# EAGLE design tdlf_23_10_2021_server (EAGLE 9.6.2)
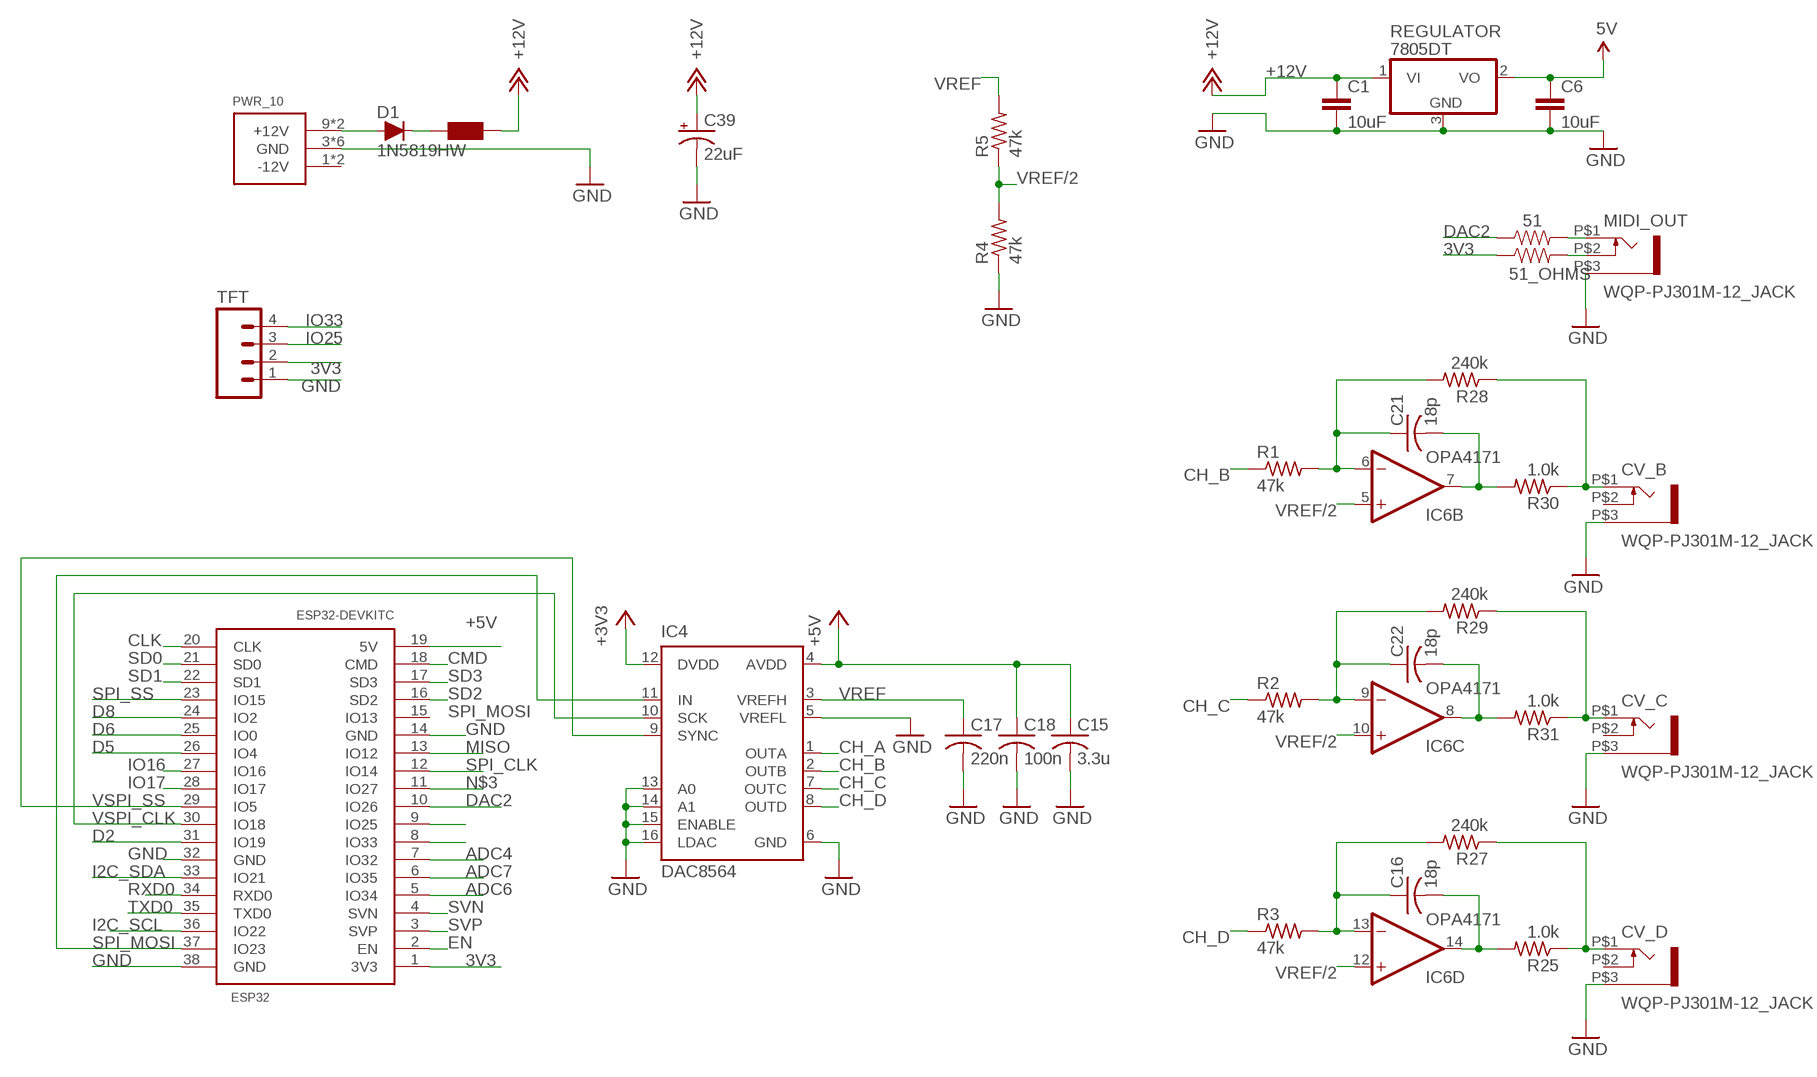
[diagram p0: schematic, sheet 1]

## Parts
51  RESISTOR1206  [1206]
51_OHMS  RESISTOR1206  [1206]
C1  10uF  CAPACITOR1210  [R1210]
C6  10uF  CAPACITOR1210  [R1210]
C15  3.3u  C-USC0603  [C0603]
C16  18p  C-USC0603  [C0603]
C17  220n  C-USC0603  [C0603]
C18  100n  C-USC0603  [C0603]
C21  18p  C-USC0603  [C0603]
C22  18p  C-USC0603  [C0603]
C39  22uF  CAP_POL1206_TANT  [1206_POL]
CV_B  WQP-PJ301M-12_JACK  [WQP-PJ301M-12_JACK]
CV_C  WQP-PJ301M-12_JACK  [WQP-PJ301M-12_JACK]
CV_D  WQP-PJ301M-12_JACK  [WQP-PJ301M-12_JACK]
D1  1N5819HW  DIODE  [SOD123]
ESP32  ESP32DEVKITC  [ESP32-DEVKITC]
F1  Würth Electronics 742792664  FERRITE-BEAD0805  [R0805]
IC4  DAC8564  [SOP65P640X110-16N]
IC6  OPA4171  TL074D  [SO14]
MIDI_OUT  WQP-PJ301M-12_JACK  [WQP-PJ301M-12_JACK]
PWR_10  POWER_SIMPLE10  [POWER_10]
R1  47k  R-US_R1206  [R1206]
R2  47k  R-US_R1206  [R1206]
R3  47k  R-US_R1206  [R1206]
R4  47k  R-US_R1206  [R1206]
R5  47k  R-US_R1206  [R1206]
R25  1.0k  R-US_R0603  [R0603]
R27  240k  R-US_R0603  [R0603]
R28  240k  R-US_R0603  [R0603]
R29  240k  R-US_R0603  [R0603]
R30  1.0k  R-US_R0603  [R0603]
R31  1.0k  R-US_R0603  [R0603]
REGULATOR  7805DT  [TO252]
TFT  M04PTH  [1X04]

## Nets
3V: 51_OHMS.2 MIDI_OUT.P$2
3V3: 51_OHMS.1 ESP32.1(3V3) TFT.2
+3V3: IC4.12(DVDD)
+5V: C6.1 C15.1 C18.1 ESP32.19(5V) IC4.4(AVDD) REGULATOR.2(VO) ; supply symbol labelled 5V
+12: D1.+ PWR_10.9(+12V) PWR_10.10(+12V)
+12V: C1.1 C39.2(+) F1.1 REGULATOR.1(VI)
ADC4: ESP32.7(IO32)
ADC6: ESP32.5(IO34)
ADC7: ESP32.6(IO35)
CH_A: IC4.1(OUTA)
CH_B: IC4.2(OUTB) R1.1
CH_C: IC4.7(OUTC) R2.1
CH_D: IC4.8(OUTD) R3.1
CLK: ESP32.20(CLK)
CMD: ESP32.18(CMD)
D2: ESP32.31(IO19)
D5: ESP32.26(IO4)
D6: ESP32.25(IO0)
D8: ESP32.24(IO2)
DAC2: 51.1 ESP32.10(IO26)
EN: ESP32.2(EN)
GND: C1.2 C6.2 C15.2 C17.2 C18.2 C39.1(-) CV_B.P$3 CV_C.P$3 CV_D.P$3 ESP32.14(GND) ESP32.32(GND) ESP32.38(GND) IC4.5(VREFL) IC4.6(GND) IC4.13(A0) IC4.14(A1) IC4.15(ENABLE) IC4.16(LDAC) MIDI_OUT.P$3 PWR_10.3(GND) PWR_10.4(GND) PWR_10.5(GND) PWR_10.6(GND) PWR_10.7(GND) PWR_10.8(GND) R4.1 REGULATOR.3(GND) TFT.1
I2C_SCL: ESP32.36(IO22)
I2C_SDA: ESP32.33(IO21)
IO16: ESP32.27(IO16)
IO17: ESP32.28(IO17)
IO25: ESP32.9(IO25) TFT.3
IO33: ESP32.8(IO33) TFT.4
MISO: ESP32.13(IO12)
N$2: C22.1 IC6.9(C:-IN) R2.2 R29.2
N$3: ESP32.11(IO27)
N$47: D1.- F1.2
N$50: C21.2 IC6.7(B:OUT) R30.2
N$51: C22.2 IC6.8(C:OUT) R31.2
N$52: C16.2 IC6.14(D:OUT) R25.2
N$55: CV_C.P$1 R29.1 R31.1
N$58: CV_D.P$1 R25.1 R27.1
N$59: C16.1 IC6.13(D:-IN) R3.2 R27.2
N$60: C21.1 IC6.6(B:-IN) R1.2 R28.2
N$63: CV_B.P$1 R28.1 R30.1
PIN27: 51.2 MIDI_OUT.P$1
RXD0: ESP32.34(RXD0)
SD0: ESP32.21(SD0)
SD1: ESP32.22(SD1)
SD2: ESP32.16(SD2)
SD3: ESP32.17(SD3)
SPI_CLK: ESP32.12(IO14)
SPI_MOSI: ESP32.37(IO23) IC4.11(IN)
SPI_SS: ESP32.23(IO15)
SVN: ESP32.4(SVN)
SVP: ESP32.3(SVP)
TXD0: ESP32.35(TXD0)
VREF: C17.1 IC4.3(VREFH) R5.2
VREF/2: IC6.5(B:+IN) IC6.10(C:+IN) IC6.12(D:+IN) R4.2 R5.1
VSPI_CLK: ESP32.30(IO18) IC4.10(SCK)
VSPI_SS: ESP32.29(IO5) IC4.9(SYNC)
Unconnected: CV_B.P$2 CV_C.P$2 CV_D.P$2 ESP32.15(IO13) IC6.1(A:OUT) IC6.2(A:-IN) IC6.3(A:+IN) PWR_10.1(-12V) PWR_10.2(-12V)

## Power pins joined to a net without a drawn wire
V+: IC6.4(P:V+)
V-: IC6.11(P:V-)

## Library data of the parts
51 51_OHMS = SparkFun-Resistors:RESISTOR: Generic Resistor Package
C1 C6 = parts_aman:CAPACITOR
C15-C18 C21 C22 = rcl:C-US: CAPACITOR, American symbol
C39 = parts_aman:CAP_POL
CV_B CV_C CV_D MIDI_OUT = thonkiconn:WQP-PJ301M-12_JACK
D1 = parts_aman:DIODE
ESP32 = ESP32-DEVKITC:ESP32DEVKITC
F1 = parts_aman:FERRITE-BEAD
IC4 = og-dac:DAC8564
IC6 = gm-ics:TL074: OP AMP
PWR_10 = parts_aman:POWER_SIMPLE
R1-R5 = rcl:R-US_: RESISTOR, American symbol; SPICEPREFIX: R
R25 R27-R31 = rcl:R-US_: RESISTOR, American symbol
REGULATOR = linear:78*: Positive VOLTAGE REGULATOR Source: http://cache.national.com/ds/LM/LM78L05.pdf http://www.fairchildsemi.com/ds/LM/LM7805.pdf
TFT = SparkFun-Connectors:M04: Header 4 Standard 4-pin 0.1" header. Use with straight break away headers (SKU : PRT-00116), right angle break away headers (PRT-00553), swiss pins (PRT-00743), machine pins (PRT-00117), and female headers (PRT-00115). Molex polarized connector foot print use with SKU : PRT-08231 with associated crimp pins and housings. 1MM SMD Version SKU: PRT-10208

## Board
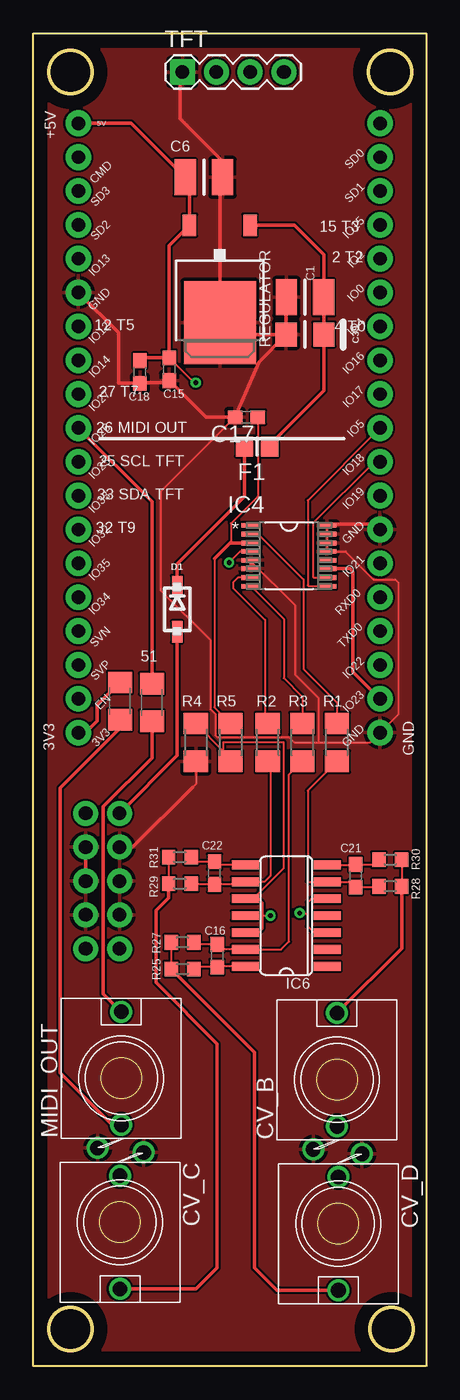
[diagram p1: board, top side]
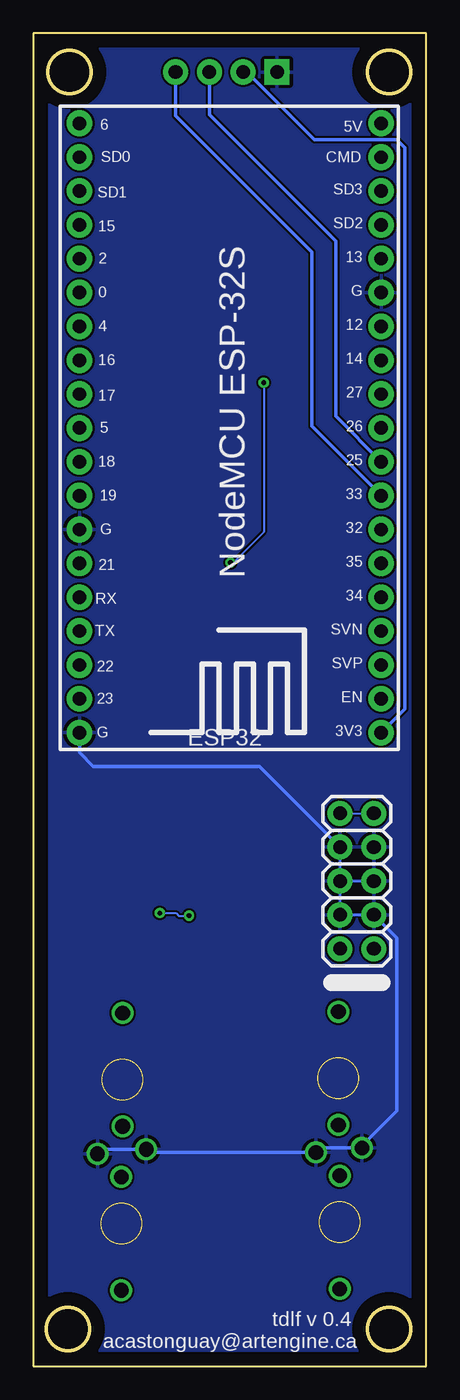
[diagram p2: board, bottom side, seen from below]

Size 29.5 x 100 mm. Coordinates in mm from the lower left corner, seen from the top.
Outline: 0,0 0,100 29.5,100 29.5,0 0,0
Outline: circle at 26.8,97.1 radius 1.62
Outline: circle at 2.8,97.1 radius 1.62
Outline: circle at 2.8,2.8 radius 1.62
Outline: circle at 26.9,2.8 radius 1.62
Copper layers (1*16): Top 0.035mm / dielectric 1.5mm / Bottom 0.035mm
Design rules "default": minimum track width 6mil, minimum drill 0.35mm, track to track 6mil, track to pad 6mil, pad to pad 6mil, via to via 6mil, smd to smd 6mil, copper to edge 40mil, drill to drill 6mil, minimum pad ring 10mil, minimum via ring 8mil, stop-mask expansion 4mil, vias tented up to drill 0mil, thermal gap 10mil

### Footprints (pad centres in the part's own frame; a part is rotated, then mirrored left to right if it is on the bottom)
1206 = smd 1.6 x 1.8: 1 -1.4,0; 2 1.4,0
R1210 = smd 1.6 x 2.7: 1 -1.4,0; 2 1.4,0
C0603 = smd 1.1 x 1: 1 -0.85,0; 2 0.85,0
1206_POL = smd 1.6 x 1.803: 1 -1.422,0; 2 1.422,0
WQP-PJ301M-12_JACK = drill 1.1: P$1 0,5; P$2 0,-3.5; P$3 -1.778,-5.23
SOD123 = smd 1.6 x 0.8: + 1.7,0; - -1.7,0
ESP32-DEVKITC = drill 1 pad 1.93: 1 -22.87,-11.42; 2 -20.33,-11.42; 3 -17.79,-11.42; 4 -15.25,-11.42; 5 -12.71,-11.42; 6 -10.17,-11.42; 7 -7.63,-11.42; 8 -5.09,-11.42; 9 -2.55,-11.42; 10 -0.01,-11.42; 11 2.53,-11.42; 12 5.07,-11.42; 13 7.61,-11.42; 14 10.15,-11.42; 15 12.69,-11.42; 16 15.23,-11.42; 17 17.77,-11.42; 18 20.31,-11.42; 19 22.85,-11.42; 20 22.85,11.23; 21 20.31,11.23; 22 17.77,11.23; 23 15.23,11.23; 24 12.69,11.23; 25 10.15,11.23; 26 7.61,11.23; 27 5.07,11.23; 28 2.53,11.23; 29 -0.01,11.23; 30 -2.55,11.23; 31 -5.09,11.23; 32 -7.63,11.23; 33 -10.17,11.23; 34 -12.71,11.23; 35 -15.25,11.23; 36 -17.79,11.23; 37 -20.33,11.23; 38 -22.87,11.23
R0805 = smd 1.3 x 1.5: 1 -0.95,0; 2 0.95,0
SOP65P640X110-16N = smd 1.422 x 0.356: 1 -2.845,2.286; 2 -2.845,1.626; 3 -2.845,0.965; 4 -2.845,0.33; 5 -2.845,-0.33; 6 -2.845,-0.965; 7 -2.845,-1.626; 8 -2.845,-2.286; 9 2.845,-2.286; 10 2.845,-1.626; 11 2.845,-0.965; 12 2.845,-0.33; 13 2.845,0.33; 14 2.845,0.965; 15 2.845,1.626; 16 2.845,2.286
SO14 = smd 0.66 x 2.032: 1 -3.81,-3.073; 2 -2.54,-3.073; 3 -1.27,-3.073; 4 0,-3.073; 5 1.27,-3.073; 6 2.54,-3.073; 7 3.81,-3.073; 8 3.81,3.073; 9 2.54,3.073; 10 1.27,3.073; 11 0,3.073; 12 -1.27,3.073; 13 -2.54,3.073; 14 -3.81,3.073
POWER_10 = drill 1.016 pad 1.88: 1 -5.08,-1.27; 2 -5.08,1.27; 3 -2.54,-1.27; 4 -2.54,1.27; 5 0,-1.27; 6 0,1.27; 7 2.54,-1.27; 8 2.54,1.27; 9 5.08,-1.27; 10 5.08,1.27
R1206 = smd 1.6 x 1.803: 1 -1.422,0; 2 1.422,0
R0603 = smd 1 x 1.1: 1 -0.85,0; 2 0.85,0
TO252 = smd 1 x 1.6: 1 -2.28,-4.8; 2 2.28,-4.8 | smd 5.4 x 6.2: 3 0,2.5
1X04 = drill 1.016 pad 1.88 square: 1 0,0 | drill 1.016 pad 1.88: 2 2.54,0; 3 5.08,0; 4 7.62,0

### Placement (x,y rotation side)
51  8.9,49.8 270 top
51_OHMS  6.5,49.9 270 top
C1  20.4,80.2 180 top
C6  12.8,89.2 0 top
C15  10.2,74.8 270 top
C16  13.8,30.8 270 top
C17  16,71.2 180 top
C18  8,74.6 270 top
C21  24.2,36.8 90 top
C22  13.6,37 90 top
C39  20.4,77.4 0 top
CV_B  22.8,21.5 0 top
CV_C  6.5,10.8 180 top
CV_D  22.9,10.7 180 top
D1  10.8,56.8 270 top
ESP32  14.8,70.4 90 bottom
F1  16.8,69 180 top
IC4  19.2,60.8 0 top
IC6  19,33.8 90 top
MIDI_OUT  6.6,21.6 0 top
PWR_10  5.2,36.4 90 bottom
R1  22.8,46.8 270 top
R2  17.6,46.8 270 top
R3  20.2,46.8 270 top
R4  12.2,46.8 90 top
R5  14.8,46.8 90 top
R25  11.2,29.8 0 top
R27  11.2,31.8 0 top
R28  26.8,36 180 top
R29  11,36.2 0 top
R30  26.8,38 180 top
R31  11,38.2 0 top
REGULATOR  14,80.8 180 top
TFT  11.2,97.1 0 top

### Tracks (layer width: path | path; a pad name or v marks a point on that pad's centre or on a via)
3V
  Top 0.254: 51_OHMS.2 6.5,47.9 2,43.4 2,22 5.9,18.1 MIDI_OUT.P$2
3V3
  Top 0.254: 51_OHMS.1 4.8,49.6 4.8,48.4 3.93,47.53 ESP32.1
  Bottom 0.254: TFT.2 13.47,97.1 8.38,92 2.21,92 1.6,91.4 1.6,49.31 ESP32.1
+5V  (via drill 0.35)
  Top 0.152: C15.1 12.05,73.8 v12.2,73.8 | v14.7,60.3 15.53,61.13 IC4.4
  Top 0.254: C18.1 8.2,75.65 C15.1 10.2,84.08 REGULATOR.2 11.72,88.88 C6.1 7.35,93.25 ESP32.19
  Bottom 0.152: v12.2,73.8 12.2,62.6 14.6,60.2 v14.7,60.3
+12
  Top 0.254: D1.+ 10.8,45.81 PWR_10.10
  Bottom 0.152: PWR_10.10 PWR_10.9
+12V
  Top 0.254: F1.1 17.75,69.13 21.82,73.2 C39.2 21.82,80.18 C1.1 21.8,83.4 19.6,85.6 REGULATOR.1
CH_B
  Top 0.152: R1.1 22.8,49.8 20.3,52.3 20.3,59.04 16.96,62.37 16.41,62.37 IC4.2
CH_C
  Top 0.152: IC4.7 15.37,59.17 15,58.8 15,58.4 17.4,56 17.4,48.42 R2.1
CH_D
  Top 0.152: IC4.8 18.8,56.07 18.8,51.62 20.2,50.22 R3.1
DAC2
  Top 0.254: ESP32.10 8.9,64.87 51.1
GND
  Top 0.152: 18.98,77.48 C39.1 | IC4.16 IC4.15 IC4.13 | IC4.14 IC4.13 | IC4.13 23.44,61.13 25.54,59.04 27.16,59.04 27.4,58.8 27.4,48.9 ESP32.38 25.3,46.8 21.4,46.8 | IC4.5 16.36,60.39 19.64,57.1 19.64,51.9 21.4,50.15 21.4,46.8 | C17.2 9.57,65.62 9.57,58.2 13.29,54.48 13.29,49.3 13.67,48.92 13.67,47.33 13.8,47.19 19.2,47.19 19.6,46.8 21.4,46.8 | R4.1 12.2,43.67 11.87,43.34
  Top 0.254: PWR_10.5 PWR_10.7 | IC4.16 22.13,63.17 25.63,63.17 ESP32.32 | IC4.5 IC4.6 | PWR_10.8 7.47,38.94 11.87,43.34 11.95,43.42 | 11.95,43.42 | C39.1 16.93,75.35 C17.2 12.95,71.2 10.38,73.78 | C15.2 10.38,73.78 | C39.1 14.9,77.4 REGULATOR.3 14,89 C6.2 14.2,90.4 11,93.6 11,96.9 TFT.1 | C1.2 18.98,80.18 C39.1 | ESP32.14 6.4,77.53 6.4,73.75 C18.2 8.03,73.78 10.38,73.78
  Bottom 0.152: PWR_10.8 PWR_10.6 | PWR_10.6 PWR_10.5 | PWR_10.6 PWR_10.4 | PWR_10.4 PWR_10.3 | 4.37,33.86 PWR_10.4
  Bottom 0.254: MIDI_OUT.P$3 5,16.37 | 5,16.37 7.94,16.37 CV_C.P$3 20.78,16.03 CV_B.P$3 24.34,16.27 CV_D.P$3 | PWR_10.3 2.2,32.13 2.2,19.17 5,16.37 | PWR_10.8 12.53,45 25,45 26.03,46.03 ESP32.38
  pour Bottom: 29,99.8 29.4,99.8 29.4,1 29.5,0.3 0.7,0.3 0.3,0.5 0.2,99.8
  pour Top: 0.5,99.7 29.29,99.7 29.29,0.3 0.3,0.3 0.3,99.7 0.5,99.9
IO25
  Bottom 0.254: TFT.3 16.28,93.88 6.8,84.4 6.8,71.27 ESP32.9
IO33
  Bottom 0.254: TFT.4 18.82,93.82 8.6,83.6 8.6,70.53 ESP32.8
N$2
  Top 0.152: R29.2 11.9,36.15 C22.1 15.74,36.15 IC6.9 17.34,36.34 17.8,36.8 17.8,45.18 R2.2
N$47
  Top 0.254: F1.2 15.85,65.25 10.8,60.2 D1.-
N$50
  Top 0.152: IC6.7 24.16,37.61 C21.2 25.6,37.65 R30.2
N$51
  Top 0.152: IC6.8 13.84,37.61 C22.2 12.2,37.85 R31.2
N$52
  Top 0.152: IC6.14 13.84,29.99 C16.2 12.2,29.95 R25.2
N$55
  Top 0.152: R31.1 R29.1
  Top 0.254: R29.1 10.15,35.15 9.2,34.2 9.2,28.8 13.8,24.2 13.8,7.4 12.2,5.8 CV_C.P$1
N$58
  Top 0.152: R27.1 R25.1
  Top 0.254: R25.1 16.6,23.55 16.6,7.4 18.3,5.7 CV_D.P$1
N$59
  Top 0.152: R27.2 12.2,31.65 C16.1 14.19,31.26 IC6.13 18.6,31.26 19.2,31.86 19.2,44.38 R3.2
N$60
  Top 0.152: R28.2 25.9,35.95 C21.1 23.81,36.34 IC6.6 20.66,36.34 20.6,36.4 20.6,43.18 R1.2
N$63
  Top 0.152: R30.1 R28.1
  Top 0.254: R28.1 27.65,31.35 CV_B.P$1
PIN27
  Top 0.254: 51.2 8.9,45.63 5.25,41.98 5.25,27.95 MIDI_OUT.P$1
SPI_MOSI
  Top 0.254: ESP32.37 24,52.1 24,59.6 23.77,59.84 IC4.11
VREF
  Top 0.152: C17.1 16.85,65.25 14.84,63.23 14.84,61.77 | 13.6,60.6 13.6,49.42 R5.2
  Top 0.254: 13.6,60.6 14.8,61.8 14.84,61.77 IC4.3
VREF/2  (via drill 0.35)
  Top 0.152: 17.2,33.8 17.2,34.8 16.93,35.07 IC6.10 16.5,35.07 18.8,37.37 18.8,46.8 14.25,46.8 14.25,46.17 | 17.2,33.8 17.2,32.8 16.93,32.53 IC6.12 | IC6.5 20.87,35.07 20.6,34.8 20.6,33.8 | 20.6,33.8 20.6,33 21.07,32.53 | 20.6,33.8 20.4,34 v20,34 | v17.81,33.8 17.2,33.8 | R4.2 14.25,46.17 | R5.1 14.8,45.62 14.25,46.17
  Bottom 0.152: v20,34 18.8,34 18.6,33.8 v17.81,33.8
VSPI_CLK
  Top 0.152: ESP32.30 25.6,67.85 21,63.25 21,59.2 21.03,59.17 IC4.10
VSPI_SS
  Top 0.152: ESP32.29 20.6,64.96 20.6,58.6 20.69,58.51 IC4.9

### Text on the board
tPlace: 3V3
tNames: +5V | 15 T3 | 2 T2 | 12 T5 | 4 T0 | 27 T7 | 26 MIDI OUT | 25 SCL TFT | 33 SDA TFT | 32 T9 | GND
bNames: tdlf v 0.4 / acastonguay@artengine.ca